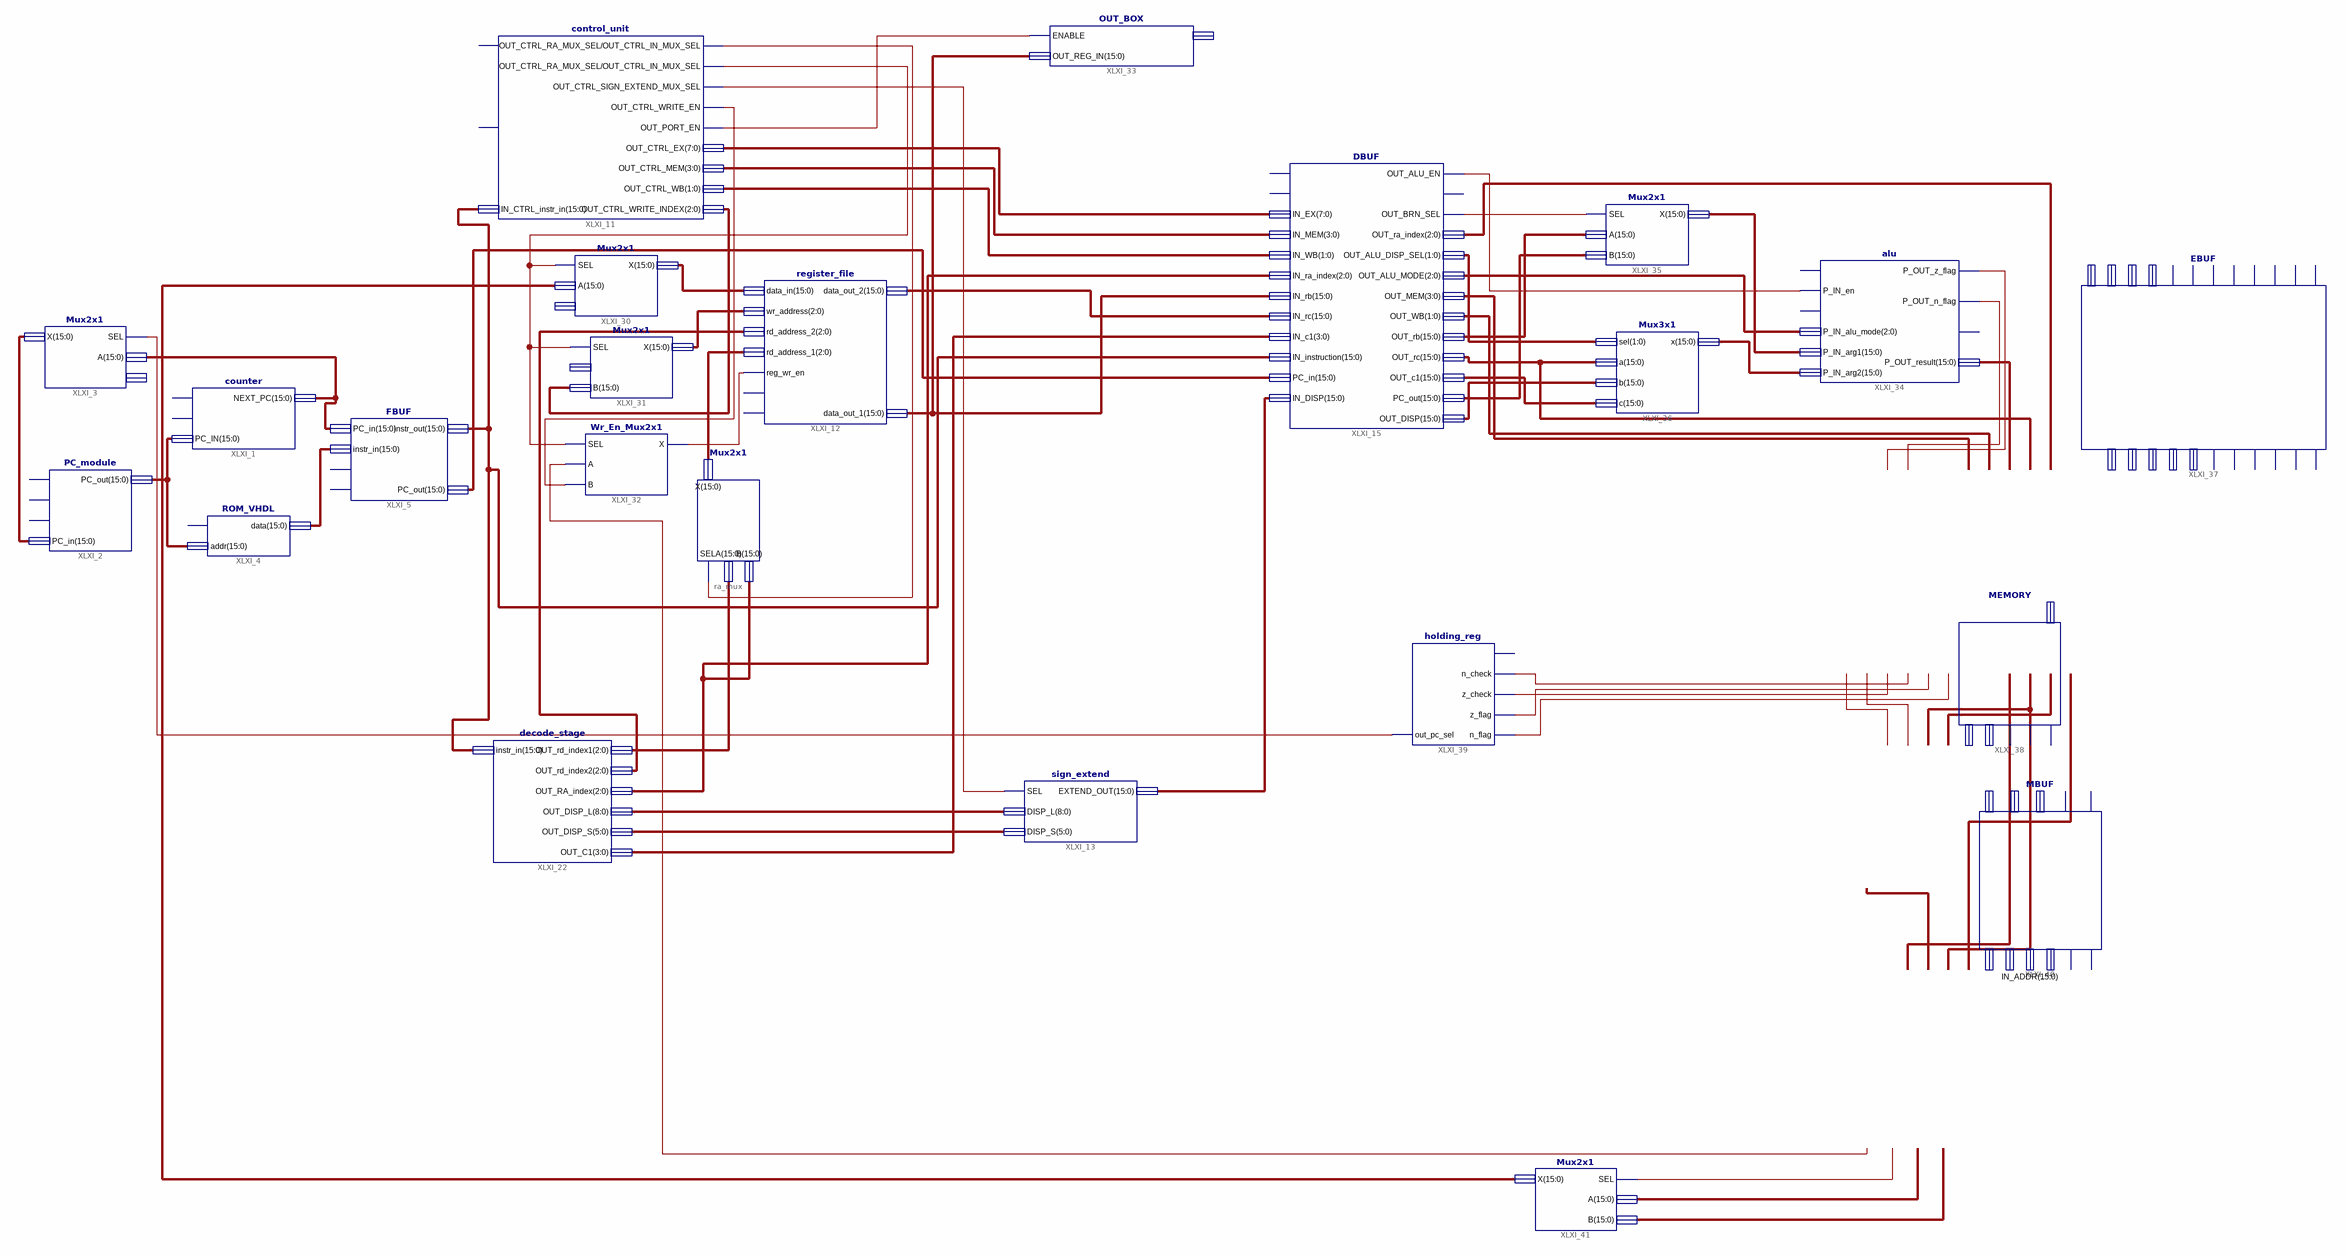
[diagram p0: schematic sheet 1]
// Xilinx ISE schematic top_schematic.sch (spartan3e) as structural Verilog: 23 symbols, 0 ports
module top_schematic (
);

  wire XLXN_58, XLXN_166, XLXN_170, XLXN_186, XLXN_188, XLXN_194, XLXN_206, XLXN_207, XLXN_208, XLXN_213,
       XLXN_214, XLXN_219, XLXN_220, XLXN_221, XLXN_222, XLXN_273, XLXN_277, XLXN_278;
  wire [1:0] XLXN_61, XLXN_195, XLXN_211, XLXN_239;
  wire [2:0] XLXN_82, XLXN_85, XLXN_203, XLXN_209, XLXN_241;
  wire [3:0] XLXN_60, XLXN_81, XLXN_210;
  wire [5:0] XLXN_57;
  wire [7:0] XLXN_59;
  wire [8:0] XLXN_56;
  wire [15:0] XLXN_1, XLXN_4, XLXN_5, XLXN_17, XLXN_49, XLXN_63, XLXN_64, XLXN_65, XLXN_119, XLXN_143,
       XLXN_162, XLXN_171, XLXN_179, XLXN_187, XLXN_192, XLXN_193, XLXN_196, XLXN_197, XLXN_198, XLXN_204,
       XLXN_205, XLXN_212, XLXN_218, XLXN_240, XLXN_242, XLXN_274, XLXN_275, XLXN_276;

  PC_module XLXI_2 (.PC_in(XLXN_17), .PC_out(XLXN_1));  // open: reset, en_global, clk
  Mux2x1 XLXI_3 (.SEL(XLXN_277), .A(XLXN_4), .X(XLXN_17));  // open: B
  FBUF XLXI_5 (.instr_in(XLXN_5), .PC_in(XLXN_4), .PC_out(XLXN_143), .instr_out(XLXN_49));  // open: clk, reset
  ROM_VHDL XLXI_4 (.addr(XLXN_1), .data(XLXN_5));  // open: clk
  counter XLXI_1 (.PC_IN(XLXN_1), .NEXT_PC(XLXN_4));  // open: reset, en_global
  decode_stage XLXI_22 (
    .instr_in(XLXN_49), .OUT_rd_index1(XLXN_119), .OUT_rd_index2(XLXN_85), .OUT_RA_index(XLXN_82),
    .OUT_DISP_L(XLXN_56), .OUT_DISP_S(XLXN_57), .OUT_C1(XLXN_81));
  sign_extend XLXI_13 (.SEL(XLXN_58), .DISP_L(XLXN_56), .DISP_S(XLXN_57), .EXTEND_OUT(XLXN_63));
  control_unit XLXI_11 (
    .IN_CTRL_instr_in(XLXN_49), .OUT_CTRL_RA_MUX_SEL(XLXN_166), .OUT_CTRL_IN_MUX_SEL(XLXN_166),
    .OUT_CTRL_SIGN_EXTEND_MUX_SEL(XLXN_58), .OUT_CTRL_WRITE_EN(XLXN_186), .OUT_PORT_EN(XLXN_188),
    .OUT_CTRL_EX(XLXN_59), .OUT_CTRL_MEM(XLXN_60), .OUT_CTRL_WB(XLXN_61), .OUT_CTRL_WRITE_INDEX(XLXN_187));  // open: RST, clk
  DBUF XLXI_15 (
    .IN_EX(XLXN_59), .IN_MEM(XLXN_60), .IN_WB(XLXN_61), .IN_ra_index(XLXN_82), .IN_rb(XLXN_64),
    .IN_rc(XLXN_65), .IN_c1(XLXN_81), .IN_instruction(XLXN_49), .PC_in(XLXN_143), .IN_DISP(XLXN_63),
    .OUT_ALU_EN(XLXN_206), .OUT_BRN_SEL(XLXN_194), .OUT_ra_index(XLXN_209), .OUT_ALU_DISP_SEL(XLXN_195),
    .OUT_ALU_MODE(XLXN_203), .OUT_MEM(XLXN_210), .OUT_WB(XLXN_211), .OUT_rb(XLXN_192), .OUT_rc(XLXN_198),
    .OUT_c1(XLXN_196), .PC_out(XLXN_193), .OUT_DISP(XLXN_197));  // open: clk, reset, OUT_ALU2_EN
  register_file XLXI_12 (
    .reg_wr_en(XLXN_170), .rd_address_1(XLXN_179), .rd_address_2(XLXN_85), .wr_address(XLXN_171),
    .data_in(XLXN_162), .data_out_1(XLXN_64), .data_out_2(XLXN_65));  // open: rst, clk
  Mux2x1 ra_mux (.SEL(XLXN_166), .A(XLXN_119), .B(XLXN_82), .X(XLXN_179));
  Mux2x1 XLXI_30 (.SEL(XLXN_166), .A(XLXN_276), .X(XLXN_162));  // open: B
  Mux2x1 XLXI_31 (.SEL(XLXN_166), .B(XLXN_187), .X(XLXN_171));  // open: A
  Wr_En_Mux2x1 XLXI_32 (.SEL(XLXN_166), .A(XLXN_278), .B(XLXN_186), .X(XLXN_170));
  OUT_BOX XLXI_33 (.ENABLE(XLXN_188), .OUT_REG_IN(XLXN_64));  // open: OUT_REG_OUT
  alu XLXI_34 (
    .P_IN_en(XLXN_206), .P_IN_alu_mode(XLXN_203), .P_IN_arg1(XLXN_204), .P_IN_arg2(XLXN_205),
    .P_OUT_z_flag(XLXN_207), .P_OUT_n_flag(XLXN_208), .P_OUT_result(XLXN_212));  // open: P_IN_rst, P_IN_clk, P_OUT_p_flag
  Mux2x1 XLXI_35 (.SEL(XLXN_194), .A(XLXN_192), .B(XLXN_193), .X(XLXN_204));
  Mux3x1 XLXI_36 (.sel(XLXN_195), .a(XLXN_198), .b(XLXN_197), .c(XLXN_196), .x(XLXN_205));
  EBUF XLXI_37 (
    .IN_Z_FLAG(XLXN_207), .IN_N_FLAG(XLXN_208), .IN_MEM(XLXN_210), .IN_WB(XLXN_211),
    .IN_ALU_RESULT(XLXN_212), .IN_DATA2(XLXN_198), .IN_RA_INDEX(XLXN_209), .OUT_MEM_WR_EN(XLXN_213),
    .OUT_MEM_READ_EN(XLXN_214), .OUT_MEM_Z_CHECK(XLXN_221), .OUT_MEM_N_CHECK(XLXN_222),
    .OUT_Z_FLAG(XLXN_219), .OUT_N_FLAG(XLXN_220), .OUT_WB(XLXN_239), .OUT_ALU_RESULT(XLXN_240),
    .OUT_DATA2(XLXN_218), .OUT_RA_INDEX(XLXN_241));  // open: clk, reset, IN_BRN_Z_FLAG, IN_BRN_N_FLAG, OUT_BRN_Z_FLAG, OUT_BRN_N_FLAG
  MEMORY XLXI_38 (
    .mem_write_en(XLXN_213), .mem_read_en(XLXN_214), .address(XLXN_240), .data_in(XLXN_218),
    .data_out(XLXN_242));  // open: rst
  holding_reg XLXI_39 (
    .n_flag(XLXN_220), .z_flag(XLXN_219), .z_check(XLXN_221), .n_check(XLXN_222), .out_pc_sel(XLXN_277));  // open: clk
  MBUF XLXI_40 (
    .IN_WB(XLXN_239), .IN_DATA_RD(XLXN_242), .IN_ADDR(XLXN_240), .RA_INDEX(XLXN_241), .OUT_WR_EN(XLXN_278),
    .OUT_WB_MUX_SEL(XLXN_273), .OUT_ADDR(XLXN_274), .OUT_DATA_RD(XLXN_275));  // open: clk, reset, OUT_RA_INDEX
  Mux2x1 XLXI_41 (.SEL(XLXN_273), .A(XLXN_274), .B(XLXN_275), .X(XLXN_276));
endmodule
